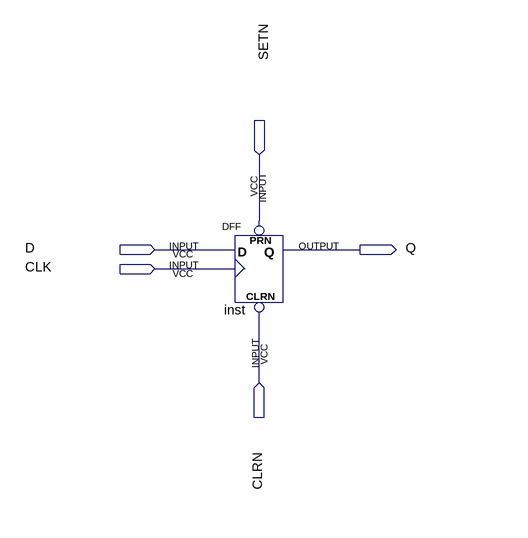
[diagram p0: schematic sheet]
// Quartus schematic lab301DFF.bdf as structural Verilog: 1 symbols, 5 pins
module lab301DFF (
  input  SETN,
  input  D,
  input  CLK,
  input  CLRN,
  output Q
);

  DFF inst (.CLRN(CLRN), .CLK(CLK), .D(D), .PRN(SETN), .Q(Q));
endmodule
